# Altium schematic sheet 3_MCU_Main.SchDoc: DB_ADCS MCU Main
size A3; DrawnBy: Augusto Cezar Boldori Vassoler; Revision: V1.0; SheetNumber: 3; SheetTotal: 7
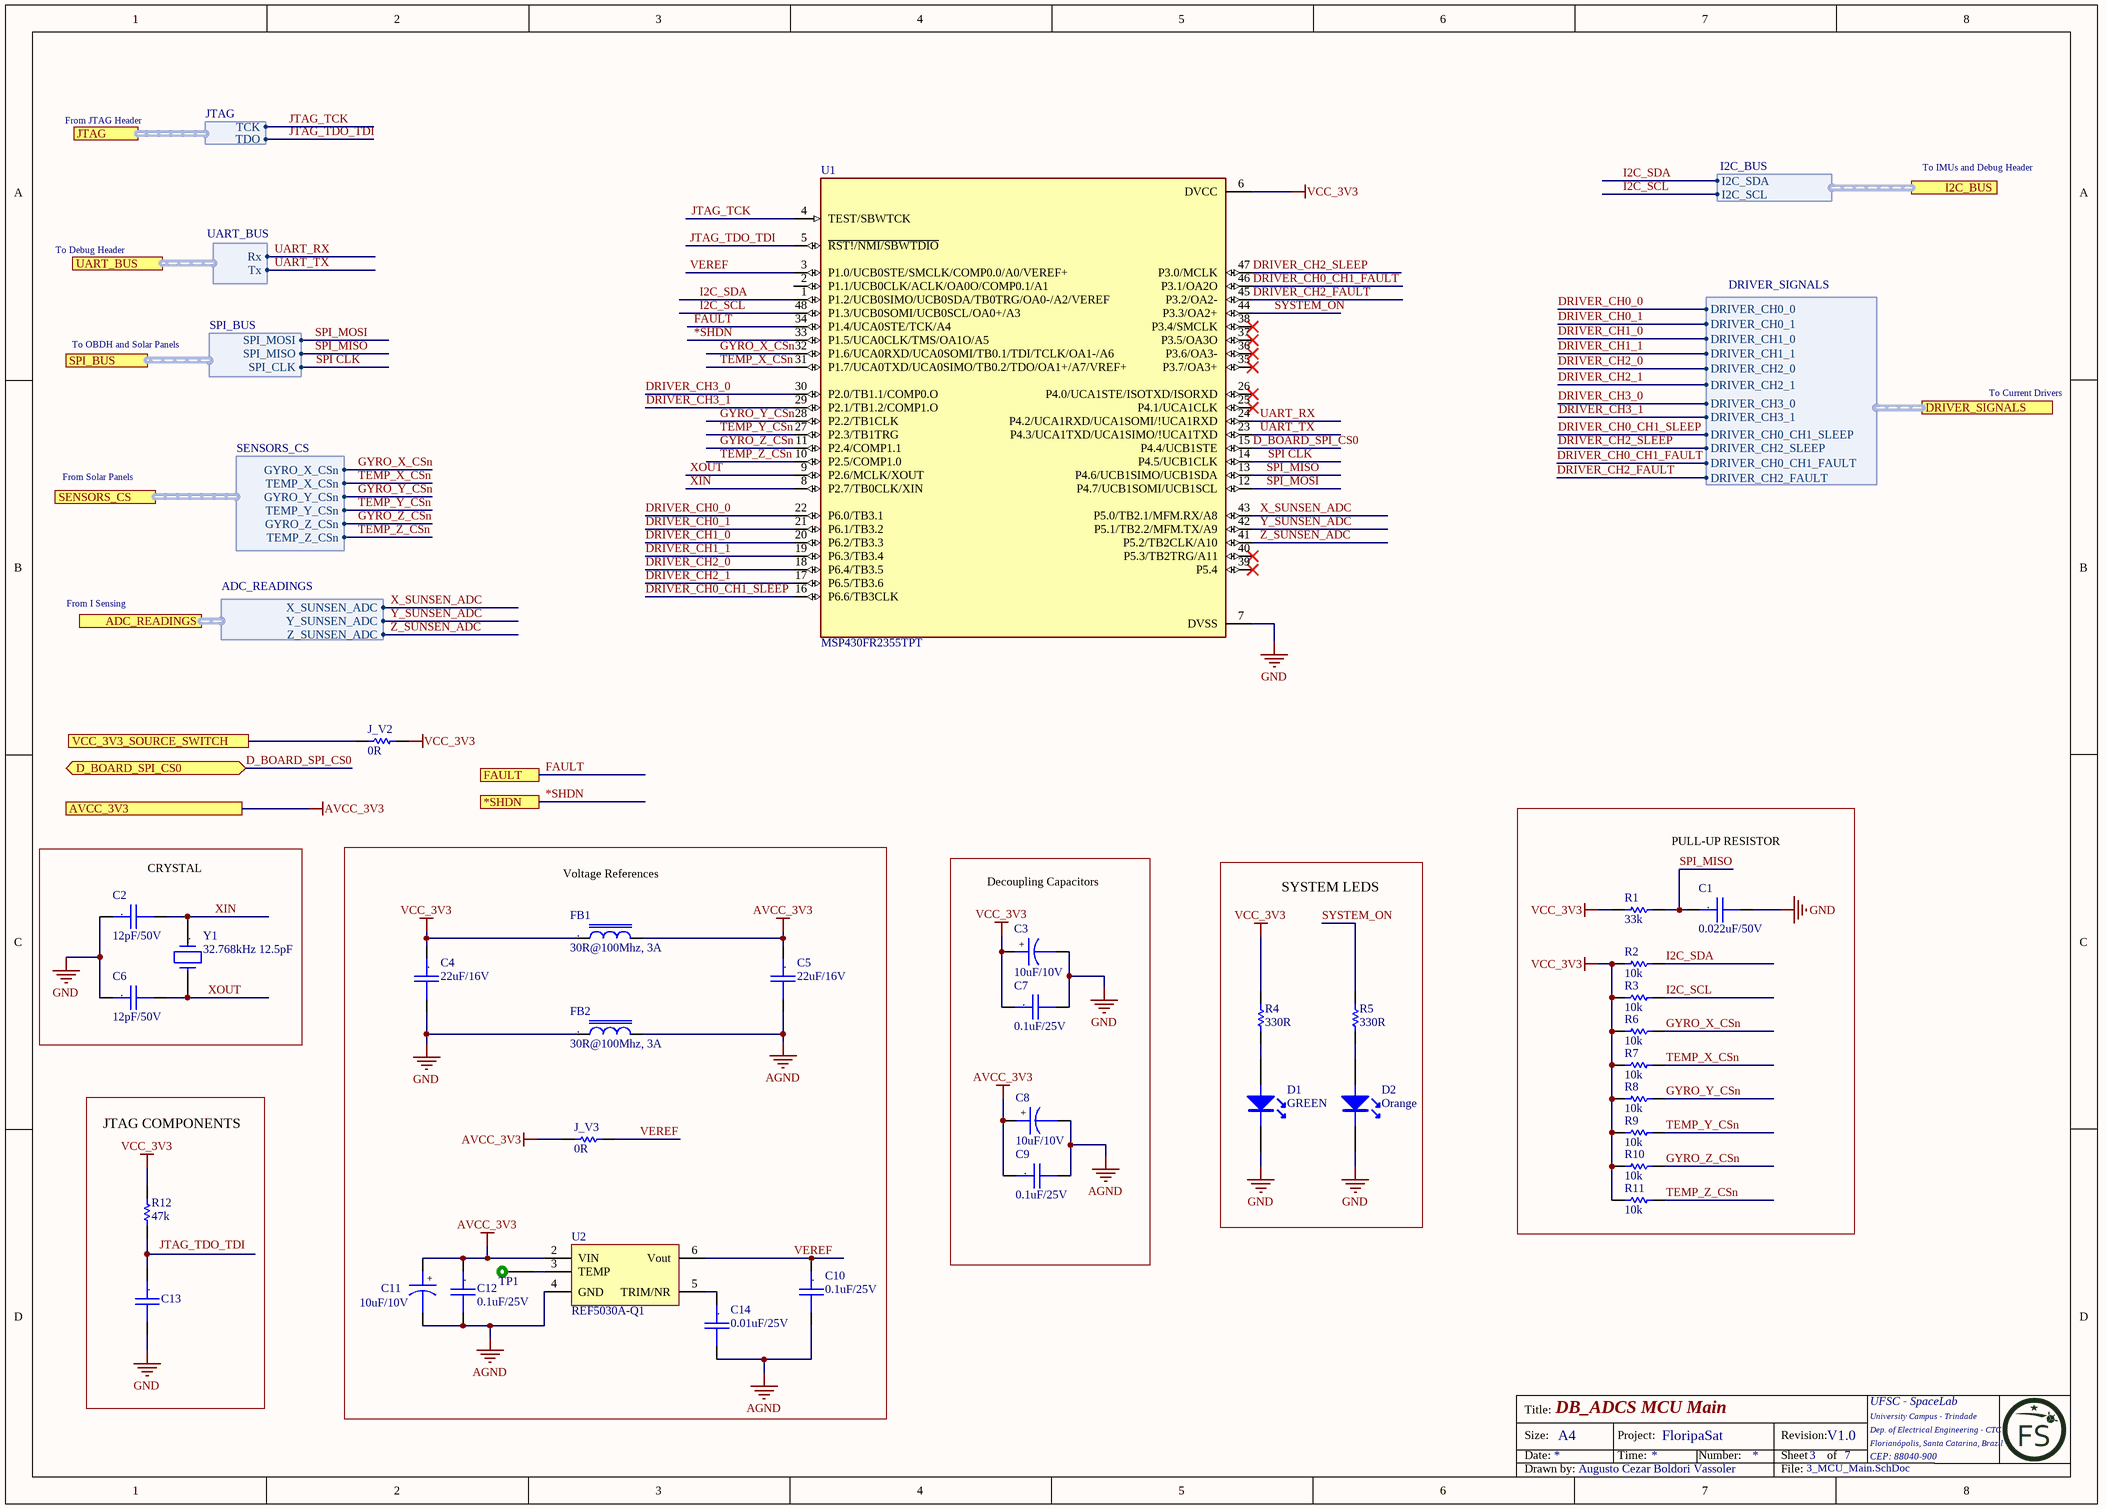
[diagram p0: 3_MCU_Main.SchDoc]

## Parts
C1  0.022uF/50V  [CC0805]
C2  12pF/50V  [CC0805]
C3  10uF/10V  [CC0805_Tantalum]
C4  22uF/16V  [CC1210]
C5  22uF/16V  [CC1210]
C6  12pF/50V  [CC0805]
C7  0.1uF/25V  [CC0805]
C8  10uF/10V  [CC0805_Tantalum]
C9  0.1uF/25V  [CC0805]
C10  0.1uF/25V  [CC0805]
C11  10uF/10V  [CC0805_Tantalum]
C12  0.1uF/25V  [CC0805]
C13  1nF/50V  [CC0805]  (value not drawn)
C14  0.01uF/25V  [CC0805]
D1  GREEN  [0805-LED]
D2  Orange  [0805-LED]
FB1  30R@100Mhz, 3A  [IND0805]
FB2  30R@100Mhz, 3A  [IND0805]
J_V2  0R  [0805-LED]
J_V3  0R  [0805-LED]
R1  33k  [0805]
R2  10k  [0805]
R3  10k  [0805]
R4  330R  [0805]
R5  330R  [0805]
R6  10k  [0805]
R7  10k  [0805]
R8  10k  [0805]
R9  10k  [0805]
R10  10k  [0805]
R11  10k  [0805]
R12  47k  [0805]
TP1  TEST_POINT_2  [TEST_POINT_2]  (value not drawn)  (no BOM)
U1  MSP430FR2355TPT  [QFP50P900X900X160-48N - duplicate]
U2  REF5030A-Q1  [SOIC-8]
Y1  32.768kHz 12.5pF  [ABS06 0805]

## Blocks framed on the sheet
PULL-UP RESISTOR: C1 R1-R3 R6-R11
CRYSTAL: C2 C6 Y1
Voltage References: C4 C5 C10-C12 C14 FB1 FB2 J_V3 TP1 U2
Decoupling Capacitors: C3 C7-C9
SYSTEM LEDS: D1 D2 R4 R5
JTAG COMPONENTS: C13 R12

## Ports
*SHDN, ADC_READINGS (harness ADC_READINGS), AVCC_3V3, D_BOARD_SPI_CS0 (bidir), DRIVER_SIGNALS (harness DRIVER_SIGNALS), FAULT, I2C_BUS (harness I2C_BUS), JTAG (harness JTAG), SENSORS_CS (harness SENSORS_CS), SPI_BUS (harness SPI_BUS), UART_BUS (harness UART_BUS), VCC_3V3_SOURCE_SWITCH

## Harnesses
UART_BUS: Rx, Tx
SPI_BUS: SPI_CLK, SPI_MISO, SPI_MOSI
SENSORS_CS: GYRO_X_CSn, TEMP_X_CSn, GYRO_Y_CSn, TEMP_Y_CSn, GYRO_Z_CSn, TEMP_Z_CSn
ADC_READINGS: Z_SUNSEN_ADC, Y_SUNSEN_ADC, X_SUNSEN_ADC
I2C_BUS: I2C_SCL, I2C_SDA
DRIVER_SIGNALS: DRIVER_CH0_CH1_SLEEP, DRIVER_CH2_SLEEP, DRIVER_CH0_CH1_FAULT, DRIVER_CH2_FAULT, DRIVER_CH2_1, DRIVER_CH2_0, DRIVER_CH1_1, DRIVER_CH1_0, DRIVER_CH0_1, DRIVER_CH0_0, DRIVER_CH3_0, DRIVER_CH3_1
JTAG: TCK, TDO

## Nets
AGND: C5.2 C8.2 C9.2 C10.2 C11.2 C12.2 C14.2 FB2.2 U2.4(GND)
AVCC_3V3: C5.1 C8.1 C9.1 C11.1 C12.1 FB1.2 J_V3.2 U2.2(VIN) ; port AVCC_3V3
GND: C1.2 C2.1 C3.2 C4.2 C6.1 C7.2 C13.2 D1.2(K) D2.2(K) FB2.1 U1.7(DVSS)
VCC_3V3: C3.1 C4.1 C7.1 FB1.1 J_V2.1 R1.2 R2.2 R3.2 R4.2 R6.2 R7.2 R8.2 R9.2 R10.2 R11.2 R12.2 U1.6(DVCC)
*SHDN: U1.33(P1.5/UCA0CLK/TMS/OA1O/A5) ; port *SHDN
D_BOARD_SPI_CS0: U1.15(P4.4/UCB1STE) ; port D_BOARD_SPI_CS0
DRIVER_CH0_0: U1.22(P6.0/TB3.1) ; port DRIVER_SIGNALS.DRIVER_CH0_0
DRIVER_CH0_1: U1.21(P6.1/TB3.2) ; port DRIVER_SIGNALS.DRIVER_CH0_1
DRIVER_CH0_CH1_FAULT: U1.46(P3.1/OA2O) ; port DRIVER_SIGNALS.DRIVER_CH0_CH1_FAULT
DRIVER_CH0_CH1_SLEEP: U1.16(P6.6/TB3CLK) ; port DRIVER_SIGNALS.DRIVER_CH0_CH1_SLEEP
DRIVER_CH1_0: U1.20(P6.2/TB3.3) ; port DRIVER_SIGNALS.DRIVER_CH1_0
DRIVER_CH1_1: U1.19(P6.3/TB3.4) ; port DRIVER_SIGNALS.DRIVER_CH1_1
DRIVER_CH2_0: U1.18(P6.4/TB3.5) ; port DRIVER_SIGNALS.DRIVER_CH2_0
DRIVER_CH2_1: U1.17(P6.5/TB3.6) ; port DRIVER_SIGNALS.DRIVER_CH2_1
DRIVER_CH2_FAULT: U1.45(P3.2/OA2-) ; port DRIVER_SIGNALS.DRIVER_CH2_FAULT
DRIVER_CH2_SLEEP: U1.47(P3.0/MCLK) ; port DRIVER_SIGNALS.DRIVER_CH2_SLEEP
DRIVER_CH3_0: U1.30(P2.0/TB1.1/COMP0.O) ; port DRIVER_SIGNALS.DRIVER_CH3_0
DRIVER_CH3_1: U1.29(P2.1/TB1.2/COMP1.O) ; port DRIVER_SIGNALS.DRIVER_CH3_1
FAULT: U1.34(P1.4/UCA0STE/TCK/A4) ; port FAULT
GYRO_X_CSn: R6.1 U1.32(P1.6/UCA0RXD/UCA0SOMI/TB0.1/TDI/TCLK/OA1-/A6) ; port SENSORS_CS.GYRO_X_CSn
GYRO_Y_CSn: R8.1 U1.28(P2.2/TB1CLK) ; port SENSORS_CS.GYRO_Y_CSn
GYRO_Z_CSn: R10.1 U1.11(P2.4/COMP1.1) ; port SENSORS_CS.GYRO_Z_CSn
I2C_SCL: R3.1 U1.48(P1.3/UCB0SOMI/UCB0SCL/OA0+/A3) ; port I2C_BUS.I2C_SCL
I2C_SDA: R2.1 U1.1(P1.2/UCB0SIMO/UCB0SDA/TB0TRG/OA0-/A2/VEREF) ; port I2C_BUS.I2C_SDA
JTAG_TCK: U1.4(TEST/SBWTCK) ; port JTAG.TCK
JTAG_TDO_TDI: U1.5(~{RST!/NMI/SBWTDIO}) ; port JTAG.TDO
SPI CLK: U1.14(P4.5/UCB1CLK) ; port SPI_BUS.SPI_CLK
SPI_MISO: C1.1 R1.1 U1.13(P4.6/UCB1SIMO/UCB1SDA) ; port SPI_BUS.SPI_MISO
SPI_MOSI: U1.12(P4.7/UCB1SOMI/UCB1SCL) ; port SPI_BUS.SPI_MOSI
SYSTEM_ON: R5.2 U1.44(P3.3/OA2+)
TEMP_X_CSn: R7.1 U1.31(P1.7/UCA0TXD/UCA0SIMO/TB0.2/TDO/OA1+/A7/VREF+) ; port SENSORS_CS.TEMP_X_CSn
TEMP_Y_CSn: R9.1 U1.27(P2.3/TB1TRG) ; port SENSORS_CS.TEMP_Y_CSn
TEMP_Z_CSn: R11.1 U1.10(P2.5/COMP1.0) ; port SENSORS_CS.TEMP_Z_CSn
UART_RX: U1.24(P4.2/UCA1RXD/UCA1SOMI/!UCA1RXD) ; port UART_BUS.Rx
UART_TX: U1.23(P4.3/UCA1TXD/UCA1SIMO/!UCA1TXD) ; port UART_BUS.Tx
VCC_3V3_SOURCE_SWITCH: J_V2.2 ; port VCC_3V3_SOURCE_SWITCH
VEREF: C10.1 J_V3.1 U1.3(P1.0/UCB0STE/SMCLK/COMP0.0/A0/VEREF+) U2.6(Vout)
X_SUNSEN_ADC: U1.43(P5.0/TB2.1/MFM.RX/A8) ; port ADC_READINGS.X_SUNSEN_ADC
XIN: C2.2 U1.8(P2.7/TB0CLK/XIN) Y1.1
XOUT: C6.2 U1.9(P2.6/MCLK/XOUT) Y1.2
Y_SUNSEN_ADC: U1.42(P5.1/TB2.2/MFM.TX/A9) ; port ADC_READINGS.Y_SUNSEN_ADC
Z_SUNSEN_ADC: U1.41(P5.2/TB2CLK/A10) ; port ADC_READINGS.Z_SUNSEN_ADC
NetC13_1: C13.1 R12.1
NetC14_1: C14.1 U2.5(TRIM/NR)
NetD1_1: D1.1(A) R4.1
NetD2_1: D2.1(A) R5.1
NetTP1_1: TP1.1 U2.3(TEMP)

Not connected (* = marked no-connect by the designer): U1 2(P1.1/UCB0CLK/ACLK/OA0O/COMP0.1/A1) 25(P4.1/UCA1CLK)* 26(P4.0/UCA1STE/ISOTXD/ISORXD)* 35(P3.7/OA3+)* 36(P3.6/OA3-)* 37(P3.5/OA3O)* 38(P3.4/SMCLK)* 39(P5.4)* 40(P5.3/TB2TRG/A11)*

## Notes on the sheet
- From JTAG Header
- To IMUs and Debug Header
- To Debug Header
- To OBDH and Solar Panels
- To Current Drivers
- From Solar Panels
- From I Sensing
- Labels drawn without touching a wire or pin: JTAG_TDO_TDI
- Title:
- Size:
- Date:
- A4
- Project:
- Time:
- FloripaSat
- Number:
- Revision:
- Sheet
- of
- UFSC - SpaceLab
- University Campus - Trindade
- Dep. of Electrical Engineering - CTC
- Florianópolis, Santa Catarina, Brazil
- CEP: 88040-900
- Drawn by:
- File:
- (in symbol Cap_Cer_X7R_0.01uF_16V_1210) .
- (in symbol Cap_Cer_X7R_0.1uF_25V_0805) .
- (in symbol Cap_Cer_X7R_0.001uF_50V_0805) .
- (in symbol Cap_Cer_X7R_0.01uF_50V_0805) .
- (in symbol Cap_Cer_X7R_0.022uF_50V_0805) .
- (in symbol Cap_Cer_X7R_12pF_50V_0805) .
- (in symbol Cap_Tant_SMD_10uF_6V3_0805) +
- (in symbol FB_30R_3A_100MHz_0805) .
- (in symbol Xtal_32.768kHz_12pF_2_SMD) .

## Library data of the parts
C1 = Cap_Cer_X7R_0.022uF_50V_0805: CAP CER 0.022UF 50V 5% X7R 0805; Partnumber: CGA4J2C0G1H223J125AA; NCM: 8532.24.10
C2 C6 = Cap_Cer_X7R_12pF_50V_0805: CAP CER 12pF 50V 0805; Partnumber: CL21C120FBANNNC; NCM: 8532.24.10
C3 C8 C11 = Cap_Tant_SMD_10uF_6V3_0805: CAP Tantalum 10uF 6.3V 10% 0805; Partnumber: TPSR106K006R1000; NCM: 8532.21.11
C4 C5 = Cap_Cer_X7R_0.01uF_16V_1210: CAP CER 22uF 16V 10% X7R 1210; Partnumber: C3225X7R1C226K250AC; NCM: 8532.24.10
C7 C9 C10 C12 = Cap_Cer_X7R_0.1uF_25V_0805: CAP CER 0.1UF 25V 10% X7R 0805; Partnumber: CC0805KRX7R8BB104; NCM: 8532.24.10
C13 = Cap_Cer_X7R_0.001uF_50V_0805: 0805 1 nF 50V ±10 % Tolerance X7R Surface Mount Multilayer Ceramic Capacitor; Manufacturer: Kyocera AVX; Manufacturer Part Number: 08055C102KAT2A; Capacitance: 1nF; Tolerance: 10%; Dissipation Factor: 2.5%; Insulation Resistance: 100GR; Supplier 1: Digi-Key; Supplier Part Number 1: 478-1371-1-ND; RoHS: Yes; Category: Ceramic Capacitors; Stock 1: 168088; Pricing 1: 1=0,13000, 10=0,09400, 100=0,04400, 500=0,03086, 1000=0,02555 (USD); Mount: Surface Mount,PCB; Case/Package: 0805; Number of Pins: 2; Case Code (Imperial): 0805; Case Code (Metric): 2012; Dielectric Material: Ceramic; Contact Plating: Tin,Matte; Min Operating Temperature: -55°C; Max Operating Temperature: 125°C; Voltage Rating: 50V; Voltage Rating (DC): 50V; Packaging: Tape and Reel; Dielectric: X7R; Termination: SMD/SMT; Package Quantity: 1; Voltage: 50V; Length: 2.01mm; Height: 0.94mm; Depth: 1.25mm; Width: 1.25mm; Thickness: 0.037inch; Radiation Hardening: No; REACH SVHC: No SVHC; Lead Free: Lead Free; ComponentLink1URL: https://datasheet.ciiva.com/11786/0900766b802d4698-11786944.pdf?src-supplier=RSComponents; ComponentLink1Description: https://datasheet.ciiva.com/11786/0900766b802d4698-11786944.pdf?src-supplier=RSComponents; ComponentLink2URL: https://datasheet.ciiva.com/19476/2009543-19476290.pdf?src-supplier=Jameco; ComponentLink2Description: https://datasheet.ciiva.com/19476/2009543-19476290.pdf?src-supplier=Jameco; ComponentLink3URL: https://datasheet.ciiva.com/150/cx7r-150264.pdf?src-supplier=Digi-Key; ComponentLink3Description: https://datasheet.ciiva.com/150/cx7r-150264.pdf?src-supplier=Digi-Key; ComponentLink4URL: https://datasheet.ciiva.com/150/cx7r-150265.pdf?src-supplier=Digi-Key; ComponentLink4Description: https://datasheet.ciiva.com/150/cx7r-150265.pdf?src-supplier=Digi-Key
C14 = Cap_Cer_X7R_0.01uF_50V_0805: CAP CER 0.01uF 25V 10% X7R 0805; Partnumber: CL21B103KAANNNC; NCM: 8532.24.10
D1 = LED/G_0805: SMD Green LED; Partnumber: LTST-C171GKT; NCM: 8541.40.21
D2 = LED/R_0603: SMD Orange LED; Partnumber: LTST-C170KFKT; NCM: 8541.40.21
FB1 FB2 = FB_30R_3A_100MHz_0805: Ferrite Bead 30 OHM 3A 100MHz; Partnumber: BLM21PG300SN1D; NCM: 8504.50.00
J_V2 J_V3 = R0R_JUMPER_1/16W_0805: RES 0R OHM 1/16W JUMPER 0805; Partnumber: CRCW08050000Z0EA; NCM: 8533.21.20
R1 = R33k_1%_1/10W_0805: RES 33K OHM 1/10W 1% 0805; Partnumber: RC0805FR-0733KL; NCM: 8533.21.20
R2 R3 R6-R11 = R10k_1%_1/8W_0805: RES 10K OHM 1/8W 1%  0805; Partnumber: CRCW080510K0FKEA; NCM: 8533.21.20
R4 R5 = R330R_1%_1/4W_0805: RES 330R OHM 1/4W 1% 0805; Partnumber: RC0805FR-07330RL; NCM: 8533.21.20
R12 = R27_5%_1/10W_0805: RES 47k OHM 1/10W 1% 0805; Partnumber: RC0805FR-0747KL; NCM: 8533.21.20
TP1 = TEST_POINT_2: Test point
U1 = MSP430FR2355TPT: CPU16 MSP430â„¢ FRAM Microcontroller IC 16-Bit 24MHz 32KB _32K x 8_ FRAM 48-LQFP _7x7_; MF: Texas Instruments; Price: None; Availability: Unavailable; MP: MSP430FR2355TPT; Package: LQFP-48 Texas Instruments; SnapEDA_Link: https://www.snapeda.com/parts/MSP430FR2355TPT/Texas%20Instruments/view-part/2780516/?ref=snap; Value: *
Y1 = Xtal_32.768kHz_12pF_2_SMD: 32.768kHz ±20ppm Crystal 12.5pF 70 kOhm -40°C ~ 125°C; Partnumber: ECS-.327-12.5-34S-TR; NCM: 8541.60.10
U2 = REF5030A-Q1: Partnumber: REF5030A-Q1